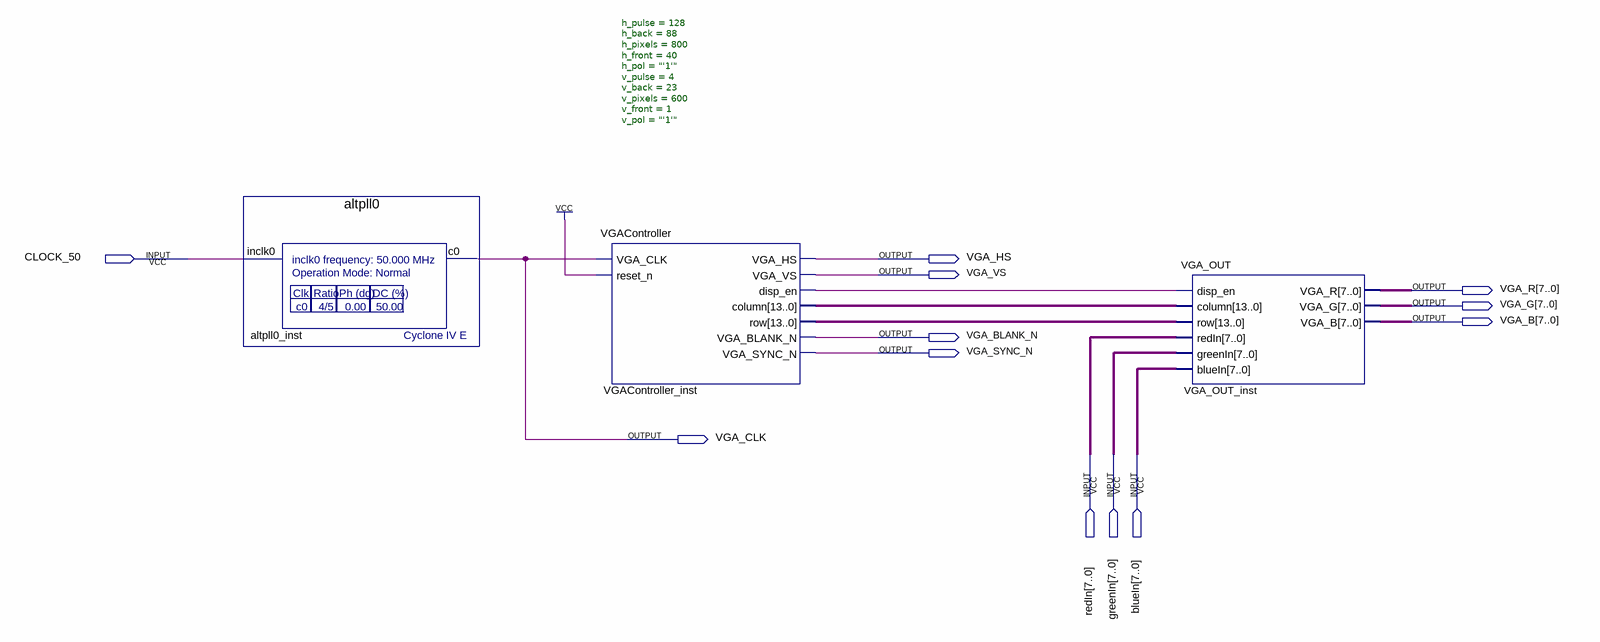
[diagram p0: schematic sheet]
// Quartus schematic ColourFiltering.bdf as structural Verilog: 3 symbols, 12 pins
module ColourFiltering (
  input  CLOCK_50,
  input  [7:0] redIn,
  input  [7:0] greenIn,
  input  [7:0] blueIn,
  output VGA_HS,
  output VGA_VS,
  output [7:0] VGA_R,
  output [7:0] VGA_G,
  output [7:0] VGA_B,
  output VGA_BLANK_N,
  output VGA_SYNC_N,
  output VGA_CLK
);

  wire VGAController_inst_disp_en;
  wire [13:0] VGAController_inst_column, VGAController_inst_row;

  altpll0 altpll0_inst (.inclk0(CLOCK_50), .c0(VGA_CLK));
  VGAController #(.h_pulse(128), .h_back(88), .h_pixels(800), .h_front(40), .h_pol("'1'"), .v_pulse(4), .v_back(23), .v_pixels(600), .v_front(1), .v_pol("'1'")) VGAController_inst (
    .VGA_CLK(VGA_CLK), .reset_n(1'b1), .VGA_HS(VGA_HS), .VGA_VS(VGA_VS),
    .disp_en(VGAController_inst_disp_en), .column(VGAController_inst_column), .row(VGAController_inst_row),
    .VGA_BLANK_N(VGA_BLANK_N), .VGA_SYNC_N(VGA_SYNC_N));
  VGA_OUT VGA_OUT_inst (
    .disp_en(VGAController_inst_disp_en), .column(VGAController_inst_column), .row(VGAController_inst_row),
    .redIn(redIn), .greenIn(greenIn), .blueIn(blueIn), .VGA_R(VGA_R), .VGA_G(VGA_G), .VGA_B(VGA_B));
endmodule
